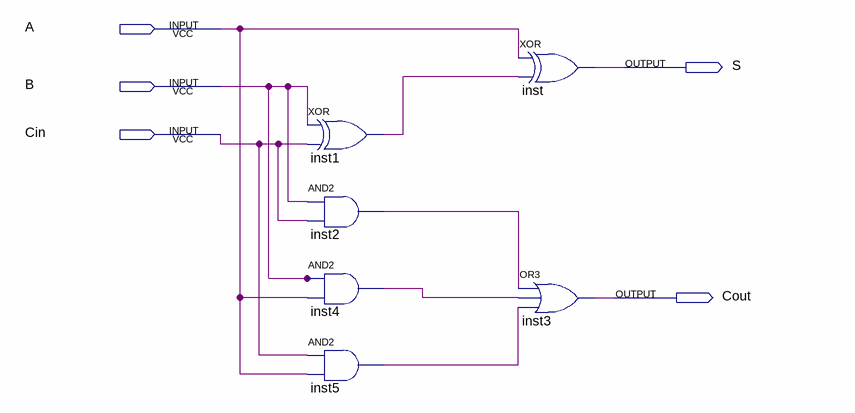
[diagram p0: schematic sheet]
// Quartus schematic Block1.bdf as structural Verilog: 6 symbols, 5 pins
module Block1 (
  input  A,
  input  B,
  input  Cin,
  output S,
  output Cout
);

  wire inst1_out, inst2_out, inst4_out, inst5_out;

  xor inst1 (inst1_out, B, Cin);
  and inst2 (inst2_out, B, Cin);
  and inst4 (inst4_out, B, A);
  and inst5 (inst5_out, Cin, A);
  xor inst (S, A, inst1_out);
  or inst3 (Cout, inst2_out, inst4_out, inst5_out);
endmodule
